# Altium schematic sheet DIGITAL_OUTPUTS_BLOCK_A.SchDoc
size A3; SheetNumber: 8; SheetTotal: 14
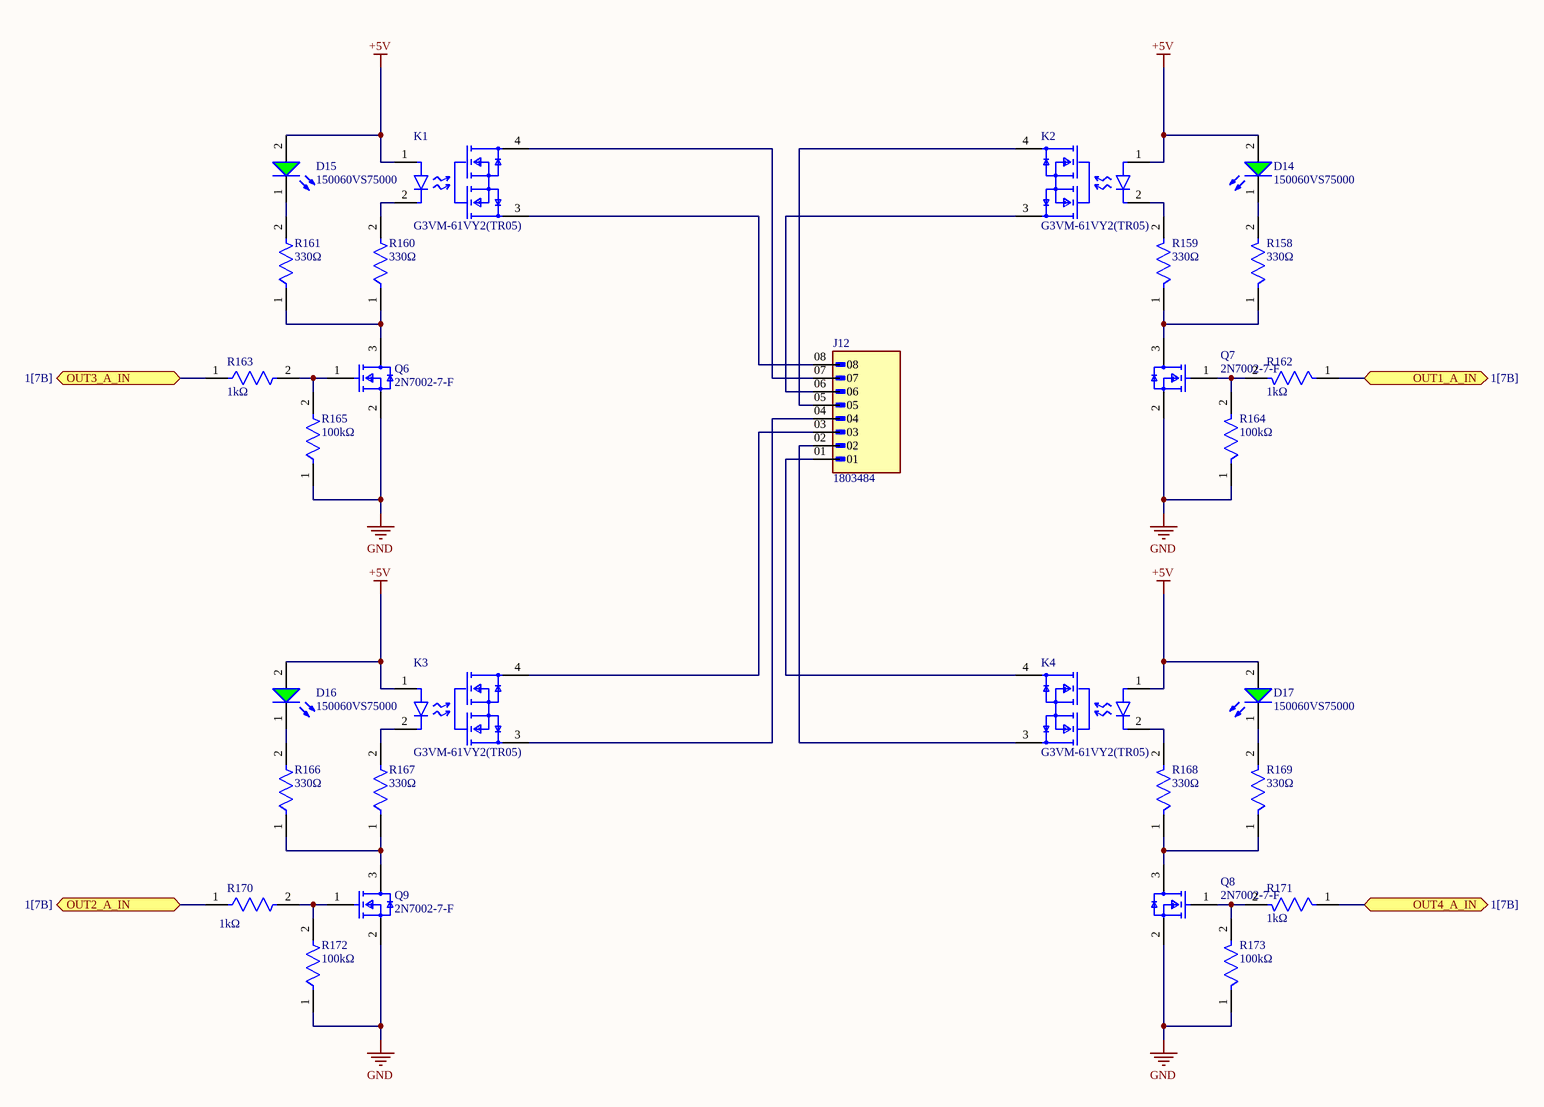
[diagram p0: DIGITAL_OUTPUTS_BLOCK_A.SchDoc]

## Parts
D14  150060VS75000  [WL-SMCW_0603_150060xx75000]
D15  150060VS75000  [WL-SMCW_0603_150060xx75000]
D16  150060VS75000  [WL-SMCW_0603_150060xx75000]
D17  150060VS75000  [WL-SMCW_0603_150060xx75000]
J12  1803484  [PHOENIX_1803484]
K1  G3VM-61VY2(TR05)  [FP-G3VM-61VY2_TR05-MFG]
K2  G3VM-61VY2(TR05)  [FP-G3VM-61VY2_TR05-MFG]
K3  G3VM-61VY2(TR05)  [FP-G3VM-61VY2_TR05-MFG]
K4  G3VM-61VY2(TR05)  [FP-G3VM-61VY2_TR05-MFG]
Q6  2N7002-7-F  [FP-SOT23-IPC_A]
Q7  2N7002-7-F  [FP-SOT23-IPC_A]
Q8  2N7002-7-F  [FP-SOT23-IPC_A]
Q9  2N7002-7-F  [FP-SOT23-IPC_A]
R158  Resistance: 330Ω  [FP-CRCW0603-e3-MFG]  (hidden comment: CRCW0603330RFKEA)
R159  Resistance: 330Ω  [FP-CRCW0603-e3-MFG]  (hidden comment: CRCW0603330RFKEA)
R160  Resistance: 330Ω  [FP-CRCW0603-e3-MFG]  (hidden comment: CRCW0603330RFKEA)
R161  Resistance: 330Ω  [FP-CRCW0603-e3-MFG]  (hidden comment: CRCW0603330RFKEA)
R162  Resistance: 1kΩ  [FP-AC0603-IPC_B]  (hidden comment: AC0603FR-071KL)
R163  Resistance: 1kΩ  [FP-AC0603-IPC_B]  (hidden comment: AC0603FR-071KL)
R164  Resistance: 100kΩ  [FP-CRCW0603-e3-IPC_B]  (hidden comment: CRCW0603100KFKEC)
R165  Resistance: 100kΩ  [FP-CRCW0603-e3-IPC_B]  (hidden comment: CRCW0603100KFKEC)
R166  Resistance: 330Ω  [FP-CRCW0603-e3-MFG]  (hidden comment: CRCW0603330RFKEA)
R167  Resistance: 330Ω  [FP-CRCW0603-e3-MFG]  (hidden comment: CRCW0603330RFKEA)
R168  Resistance: 330Ω  [FP-CRCW0603-e3-MFG]  (hidden comment: CRCW0603330RFKEA)
R169  Resistance: 330Ω  [FP-CRCW0603-e3-MFG]  (hidden comment: CRCW0603330RFKEA)
R170  Resistance: 1kΩ  [FP-AC0603-IPC_B]  (hidden comment: AC0603FR-071KL)
R171  Resistance: 1kΩ  [FP-AC0603-IPC_B]  (hidden comment: AC0603FR-071KL)
R172  Resistance: 100kΩ  [FP-CRCW0603-e3-IPC_B]  (hidden comment: CRCW0603100KFKEC)
R173  Resistance: 100kΩ  [FP-CRCW0603-e3-IPC_B]  (hidden comment: CRCW0603100KFKEC)

## Ports
OUT1_A_IN (bidir, see 1[7B]), OUT2_A_IN (bidir, see 1[7B]), OUT3_A_IN (bidir, see 1[7B]), OUT4_A_IN (bidir, see 1[7B])

## Nets
+5V: D14.2(A) D15.2(A) D16.2(A) D17.2(A) K1.1(A) K2.1(A) K3.1(A) K4.1(A)
GND: Q6.2(S) Q7.2(S) Q8.2(S) Q9.2(S) R164.1 R165.1 R172.1 R173.1
OUT1_A_IN: R162.1 ; port OUT1_A_IN
OUT2_A_IN: R170.1 ; port OUT2_A_IN
OUT3_A_IN: R163.1 ; port OUT3_A_IN
OUT4_A_IN: R171.1 ; port OUT4_A_IN
NetD14_1: D14.1(K) R158.2
NetD15_1: D15.1(K) R161.2
NetD16_1: D16.1(K) R166.2
NetD17_1: D17.1(K) R169.2
NetJ12_01: J12.01 K4.4(2_DRAIN)
NetJ12_02: J12.02 K4.3(1_DRAIN)
NetJ12_03: J12.03 K3.4(2_DRAIN)
NetJ12_04: J12.04 K3.3(1_DRAIN)
NetJ12_05: J12.05 K2.4(2_DRAIN)
NetJ12_06: J12.06 K2.3(1_DRAIN)
NetJ12_07: J12.07 K1.4(2_DRAIN)
NetJ12_08: J12.08 K1.3(1_DRAIN)
NetK1_2: K1.2(C) R160.2
NetK2_2: K2.2(C) R159.2
NetK3_2: K3.2(C) R167.2
NetK4_2: K4.2(C) R168.2
NetQ6_1: Q6.1(G) R163.2 R165.2
NetQ6_3: Q6.3(D) R160.1 R161.1
NetQ7_1: Q7.1(G) R162.2 R164.2
NetQ7_3: Q7.3(D) R158.1 R159.1
NetQ8_1: Q8.1(G) R171.2 R173.2
NetQ8_3: Q8.3(D) R168.1 R169.1
NetQ9_1: Q9.1(G) R170.2 R172.2
NetQ9_3: Q9.3(D) R166.1 R167.1

## Library data of the parts
D14-D17 = CMP-1426-00006-6: NexarPartId: 29717778; Reverse Voltage: 5V; Forward Voltage: 2V; Viewing Angle: 140°; Luminous Intensity: 40mcd; Test Current: 20mA; Max Junction Temperature (Tj): 95°C; Wavelength: 570nm; Forward Current: 100mA; Color: Green; Lens Style: Clear, Rectangular; Power Dissipation: 72mW; Peak Wavelength: 572nm; Packaging: Tape and Reel; REACH SVHC: Unknown; Width: 800µm; Max Operating Temperature: 85°C; Number of Pins: 2; RoHS: Compliant; Dominant Wavelength: 570nm; Min Operating Temperature: -40°C; Case Code (Imperial): 0603; Height: 700µm; Length: 1.6mm; Case Code (Metric): 1608; Case/Package: 0603; Max Reverse Voltage (DC): 5V; Mount: Surface Mount
J12 = 1803484: MF: {'manufacturer': u'Phoenix Contact'}; Package: None; Price: None; Value: *; MP: 1803484; Availability: Unavailable
K1-K4 = CMP-08825-000057-1: SSR RELAY SPST-NO 500MA 0-60V; Throw Configuration: SPST; On-State Resistance: 2R; Load Current: 500mA; RoHS Compliant: Yes; Relay Type: Relay; Case/Package: SOP; Mount: Surface Mount; Termination: Gull Wing; Number of Pins: 4; Packaging: Tape and Reel
Q6-Q9 = CMP-2000-04929-2: MOSFET N-CH 60V 115MA SOT23-3; Turn-On Delay Time: 7ns; Turn-Off Delay Time: 11ns; Drain to Source Resistance: 7.5R; Rise Time: 3ns; Drain to Source Breakdown Voltage: 70V; Input Capacitance: 50pF; Number of Elements: 1; Power Dissipation: 540mW; Max Power Dissipation: 300mW; Fall Time: 5.6ns; Gate to Source Voltage (Vgs): 20V; Threshold Voltage: 2.5V; Element Configuration: Single; Termination: SMD/SMT; Weight: 0.000282oz; Radiation Hardening: No; Max Operating Temperature: 150°C; On-State Resistance: 7.5R; Mount: Surface Mount; Current Rating: 115mA; Contact Plating: Tin; Lead Free: Lead Free; Min Operating Temperature: -55°C; Number of Pins: 3; REACH SVHC: No SVHC; Drain to Source Voltage (Vdss): 60V; Width: 1.3mm; Package Quantity: 3000; Length: 2.9mm; Case/Package: SOT-23; Number of Channels: 1; Dual Supply Voltage: 60V; Packaging: Tape and Reel; Height: 1mm; Voltage Rating (DC): 60V; Nominal Vgs: 2.5V; Continuous Drain Current (ID): 115mA; Voltage: 60V; Rds On Max: 7.5R
R158-R161 R166-R169 = CMP-1012-00454-3: RES Thick Film, 330Ω, 1%, 0.1W, 100ppm/°C, 0603; Voltage Rating: 75V; Max Power Dissipation: 100mW; Depth: 0.85mm; Contact Plating: Tin; Package Quantity: 10; Termination: SMD/SMT; Tolerance: 1%; Height: 0.45mm; Number of Terminations: 2; Radiation Hardening: No; Features: Automotive AEC-Q200; Case/Package: 0603; Mount: Surface Mount; Case Code (Metric): 1608; Lead Free: Lead Free; Temperature Coefficient: 100ppm/°C; Weight: 7.1E-05oz; Military Standard: Not; Packaging: Tape and Reel; Max Operating Temperature: 155°C; Voltage Rating (DC): 75V; Length: 1.55mm; Min Operating Temperature: -55°C; Composition: Thick Film; Case Code (Imperial): 0603; Width: 0.033inch; Power Rating: 100mW
R162 R163 R170 R171 = CMP-2000-04828-3: RES 1kΩ 1.00% 0.1W 0603; Voltage Rating: 50V; Power Rating: 100mW; Tolerance: 1%; Temperature Coefficient: 100ppm/°C; Depth: 0.8mm; Case/Package: 0603; Size Code: 0603; Case Code (Metric): 1608; Height: 0.022inch; Series: AC; Width: 0.031inch; Construction: Rectangular; Length: 0.063inch; Case Code (Imperial): 0603; Package Quantity: 1; RoHS Compliant: Yes; Features: Moisture Resistant; Resistor Type: Thick Film; Max Power Dissipation: 100mW; Packaging: Tape and Reel; Termination: SMD/SMT; Ratings: AEC-Q200; Max Operating Temperature: 155°C; Min Operating Temperature: -55°C; Military Standard: Not; Lead Free: Lead Free; Number of Terminations: 2
R164 R165 R172 R173 = CMP-2000-03822-2: RES Thick Film, 100kΩ, 1%, 0.1W, 100ppm/°C, 0603; Power Rating: 100mW; Height: 0.02inch; Min Operating Temperature: -55°C; Length: 0.061inch; Temperature Coefficient: 100ppm/°C; Number of Terminations: 2; Packaging: Tape and Reel; Case Code (Imperial): 0603; Case/Package: 0603; Contact Plating: Tin; Radiation Hardening: No; Lead Free: Lead Free; Depth: 0.85mm; Case Code (Metric): 1608; Max Power Dissipation: 100mW; Features: Automotive AEC-Q200; Tolerance: 1%; Max Operating Temperature: 155°C; Composition: Thick Film; Military Standard: Not; Width: 0.033inch